# EasyEDA schematic C128toSCART_SMT_V2_2021-01-28.json

## Sheets
1 C128toSCART_SMT_V2#2: TITLE: C128toSCART_SMT_V2; REV: 2.0; Date: 2020-05-27; Sheet: 2/2; Drawn By: Jdet; Company: JDet
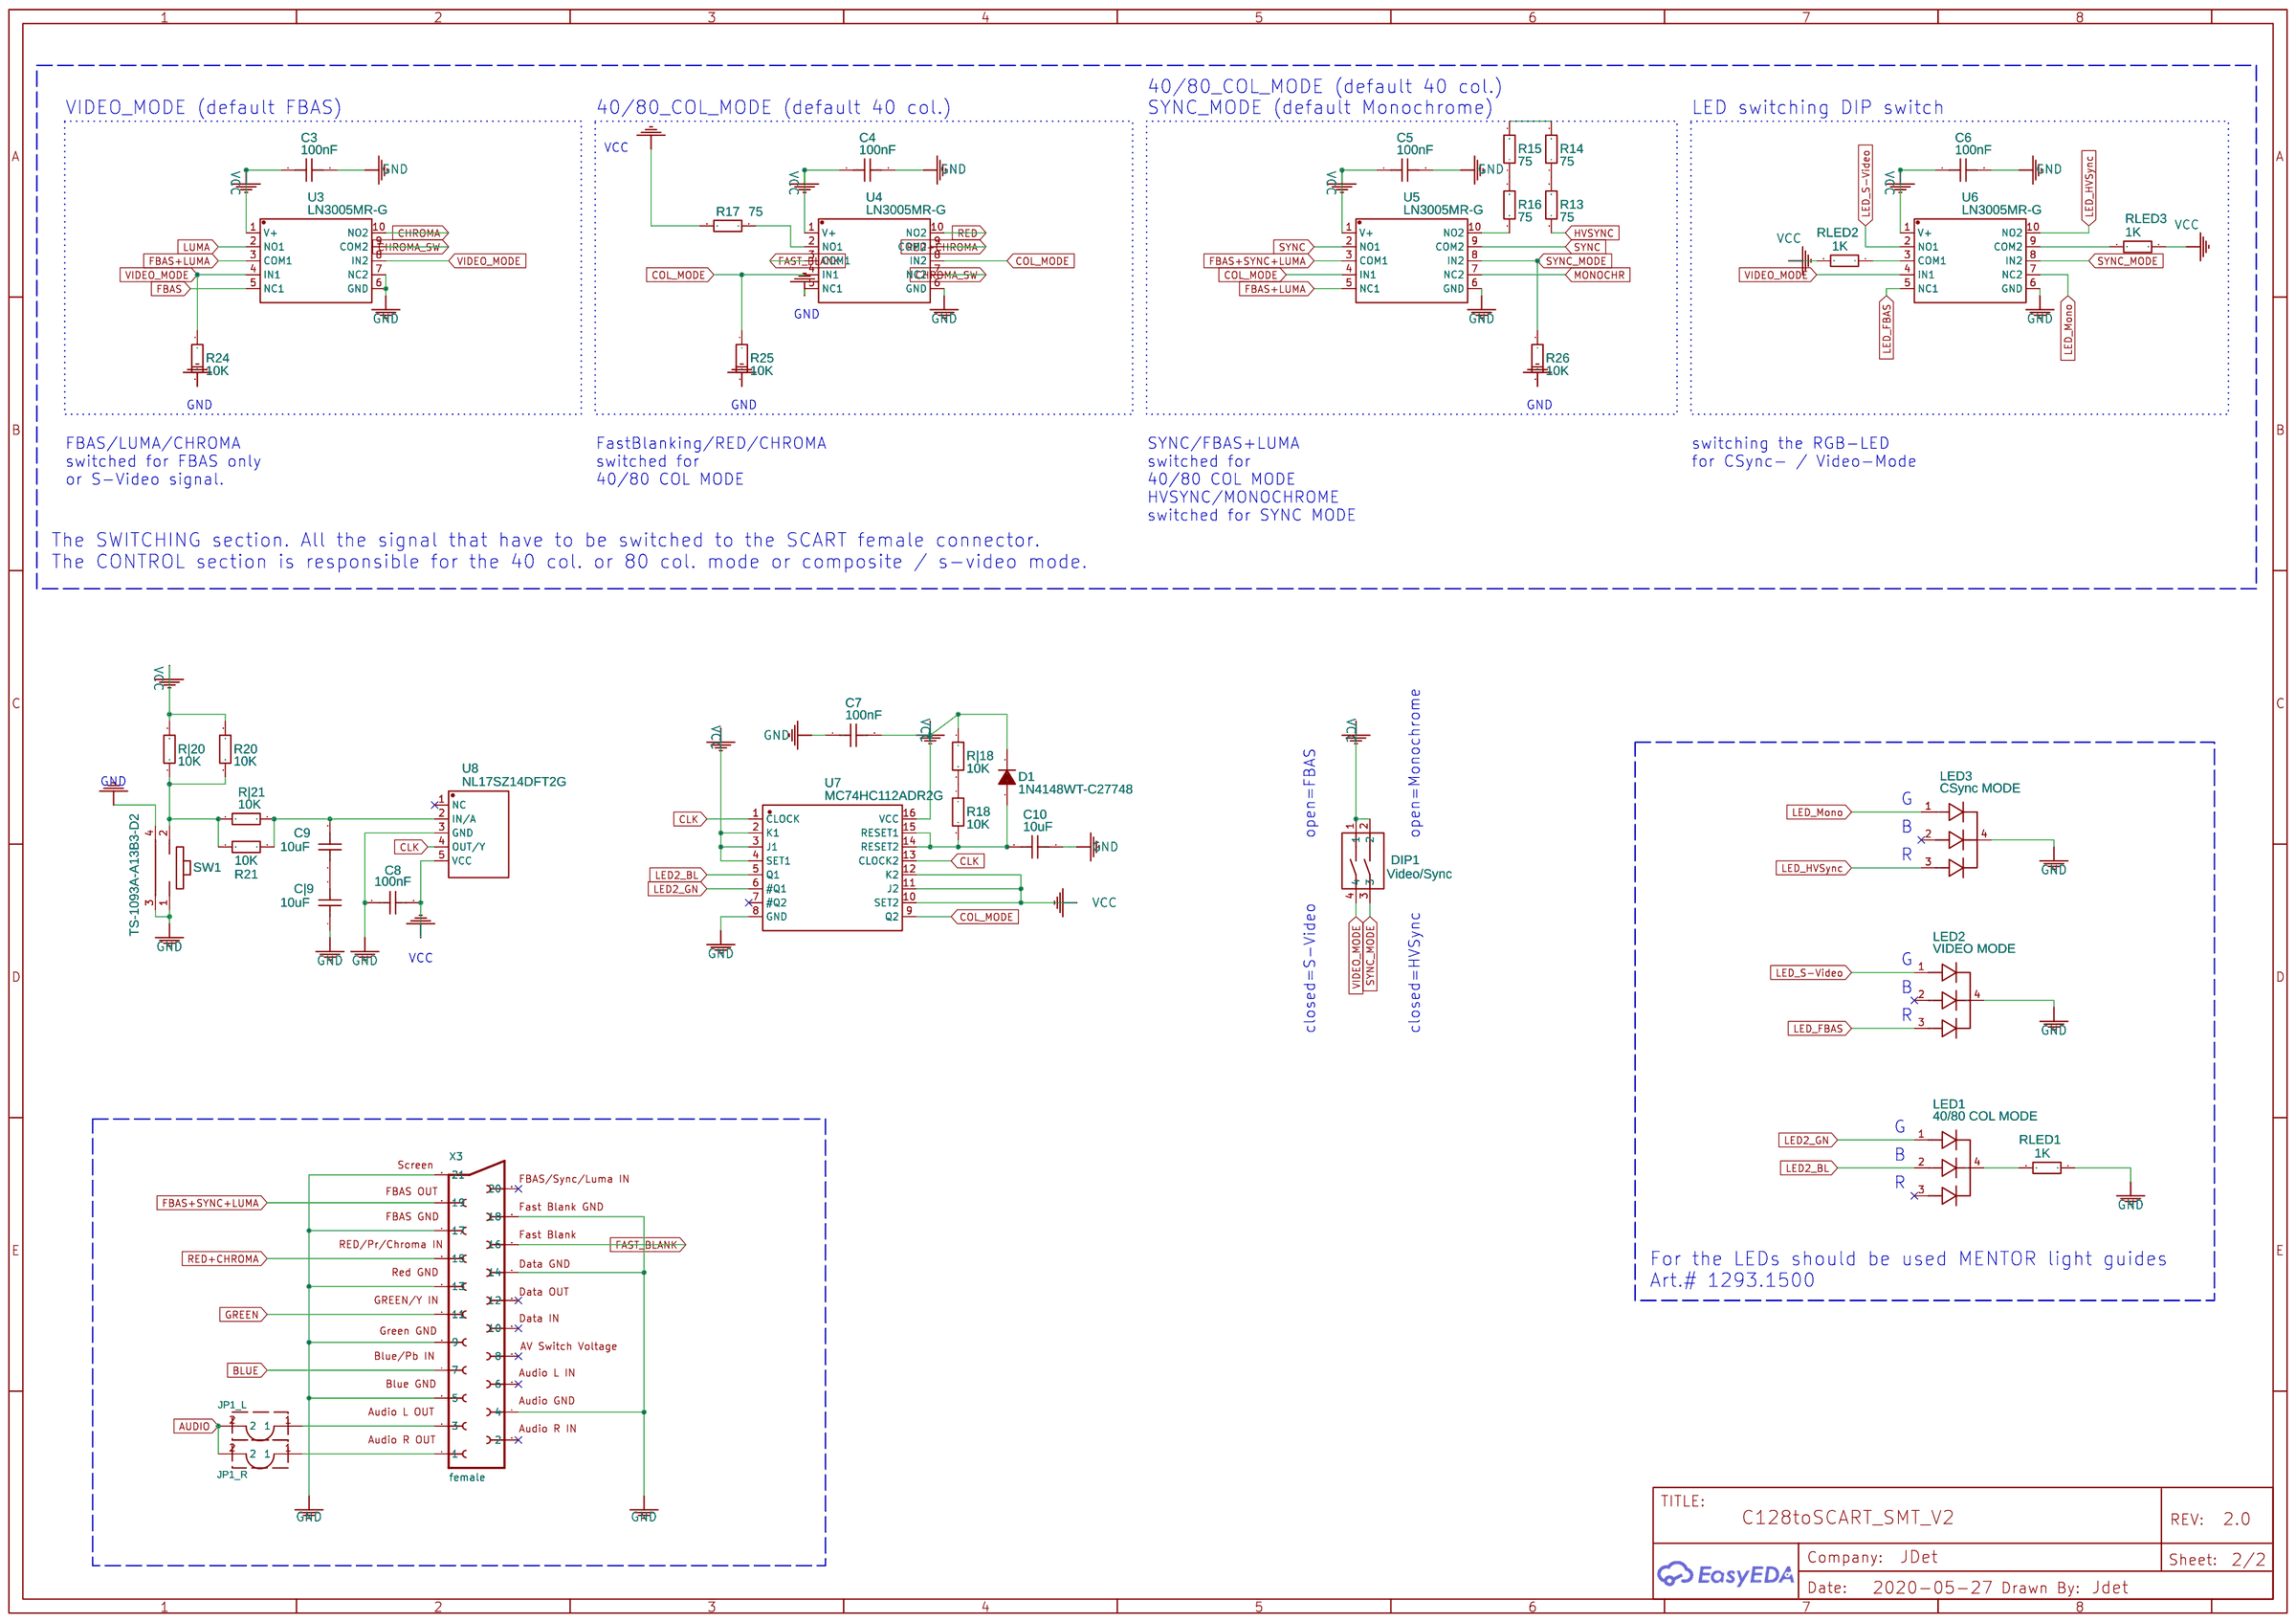
[diagram p0: C128toSCART_SMT_V2#2]
2 C128toSCART_SMT_V2#1: Sheet: 1/2; Drawn By: JDet
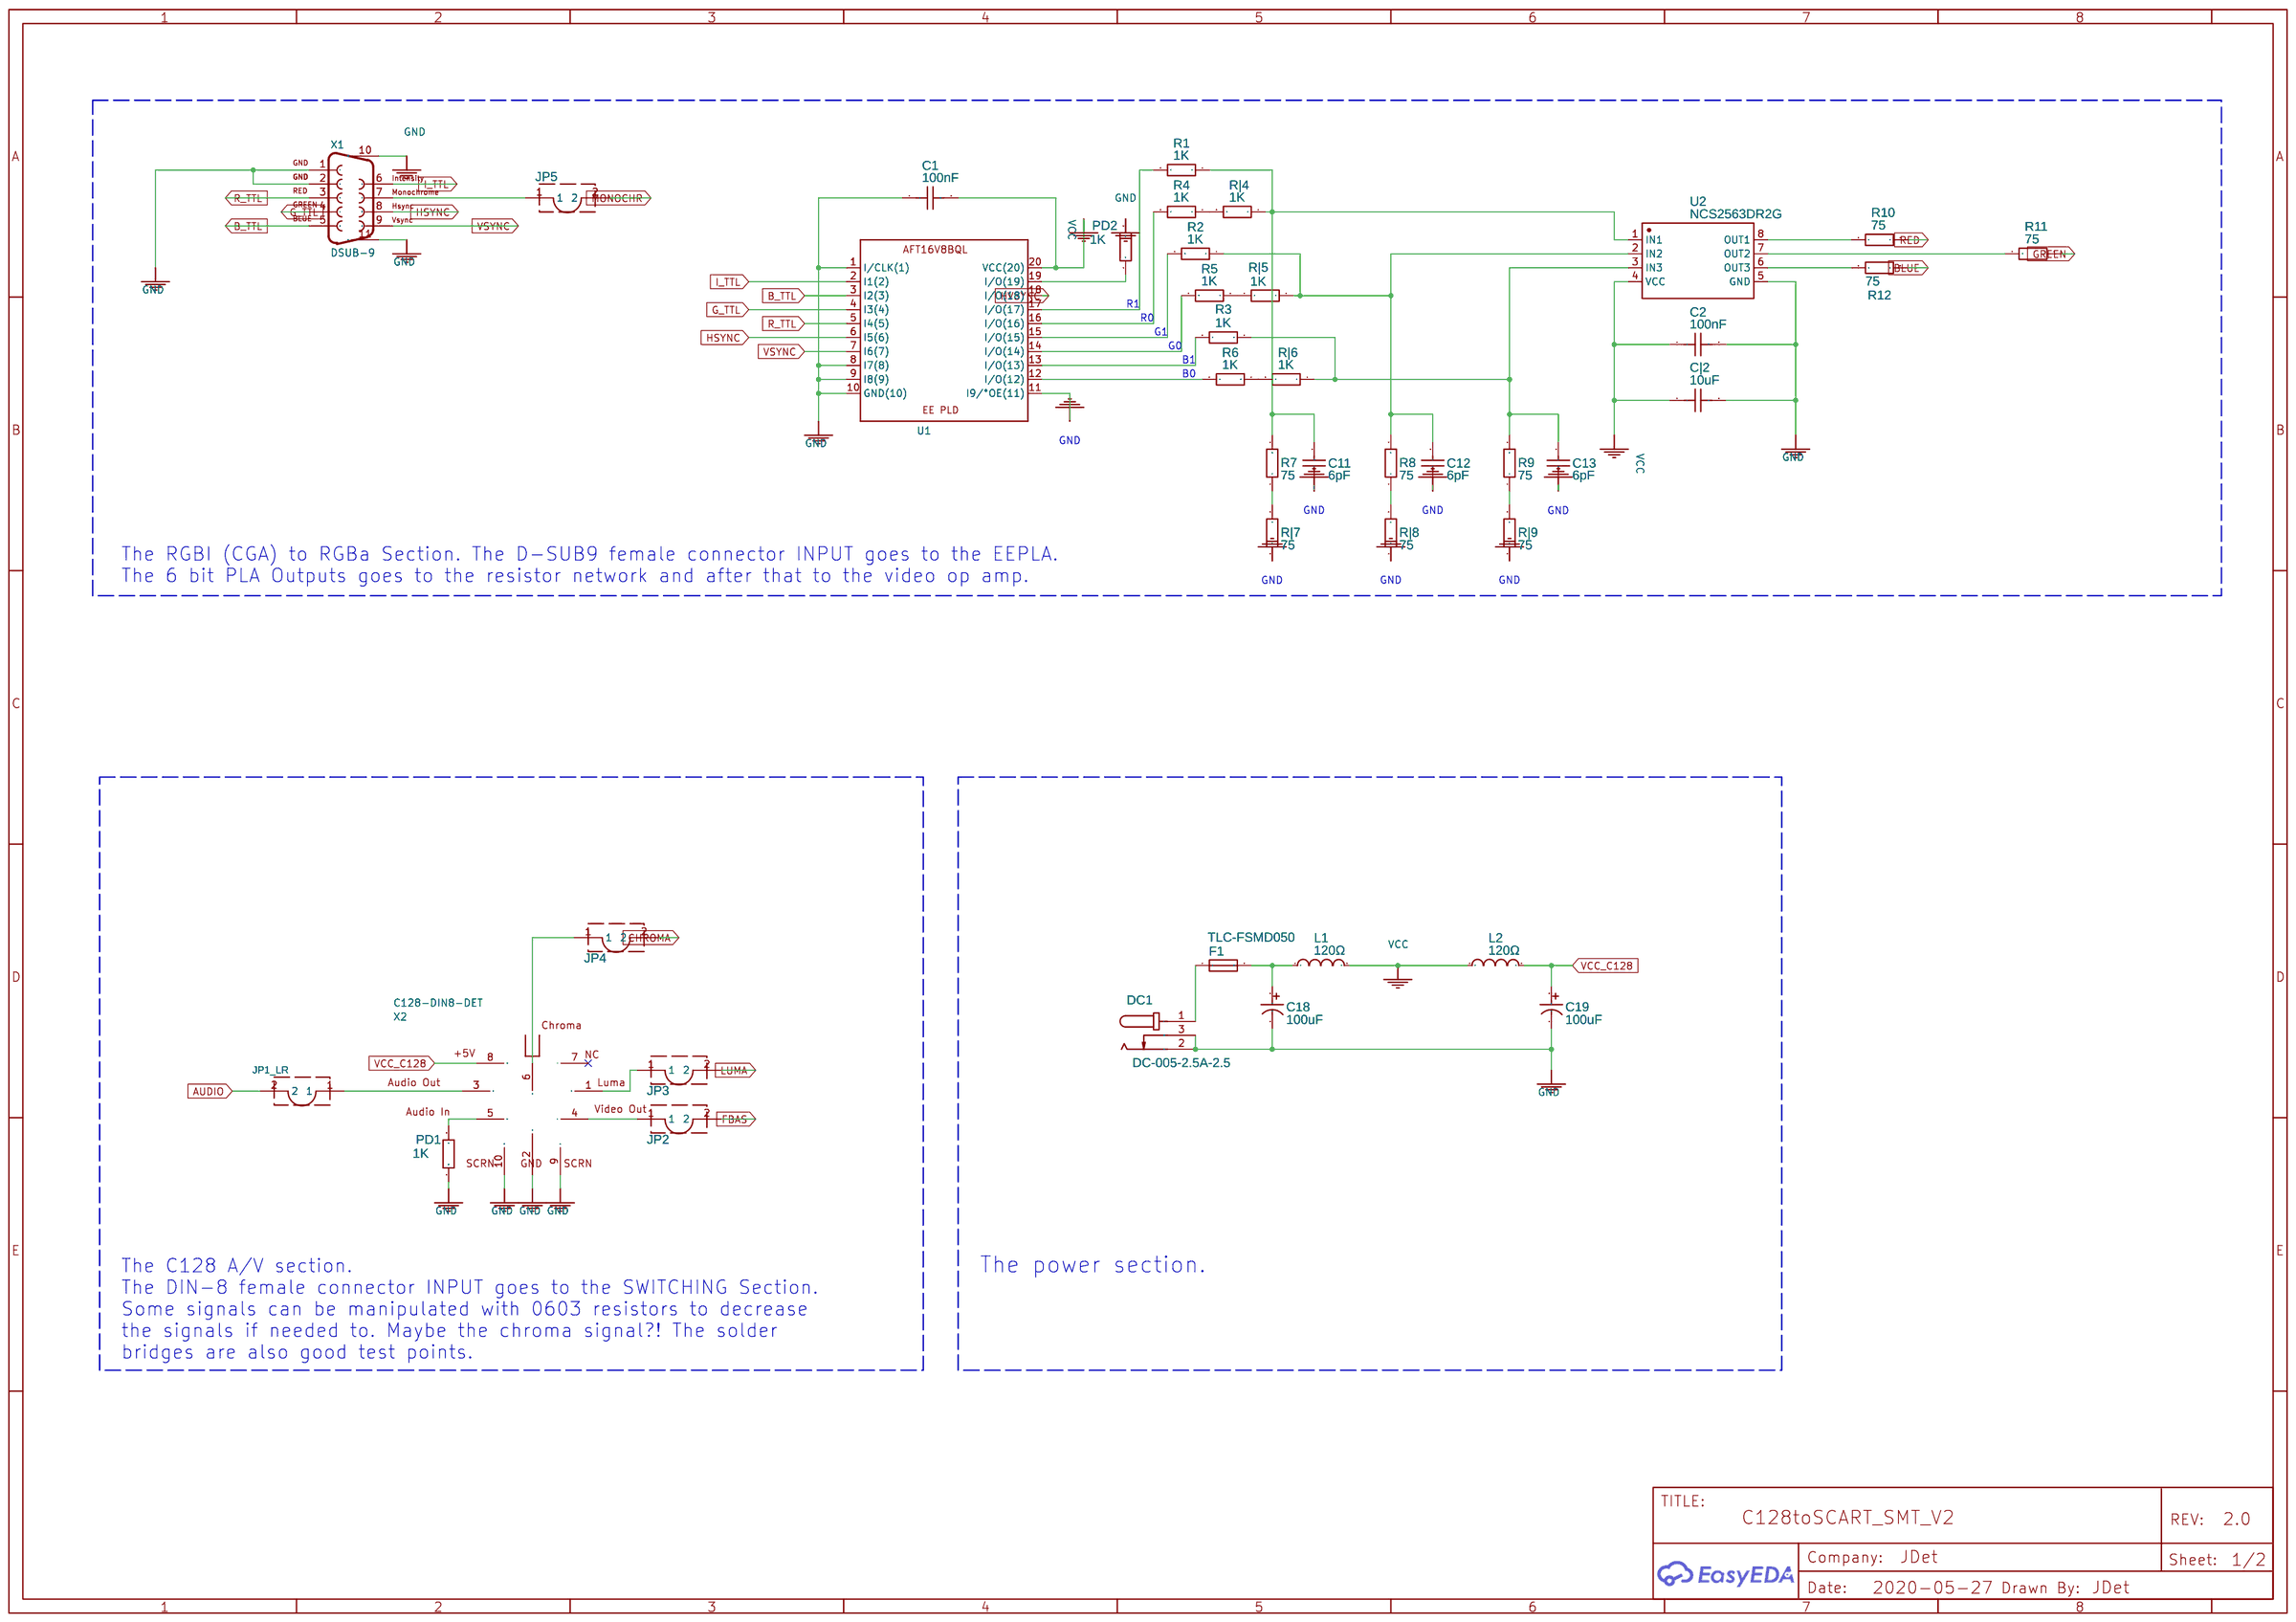
[diagram p1: C128toSCART_SMT_V2#1]

## Parts
sheet C128toSCART_SMT_V2#1
C1  100nF  [C0603]
C2  100nF  [C0603]
C11  6pF  [C0603]
C12  6pF  [C0603]
C13  6pF  [C0603]
C18  100uF  [CAP-SMD_BD5.0-L5.3-W5.3-RD]
C19  100uF  [CAP-SMD_BD5.0-L5.3-W5.3-RD]
C|2  10uF  [C0603]
DC1  DC-005-2.5A-2.5  [CONN-TH_DC-005-2.5A-2.0]
F1  TLC-FSMD050  [F0603]
JP1_LR  JUMPER_CLOSED  [JP_SMD_0603_CLOSED]
JP2  JUMPER_CLOSED  [JP_SMD_0603_CLOSED]
JP3  JUMPER_CLOSED  [JP_SMD_0603_CLOSED]
JP4  JUMPER_CLOSED  [JP_SMD_0603_CLOSED]
JP5  JUMPER_CLOSED  [JP_SMD_0603_CLOSED]
L1  120Ω  [L0603]
L2  120Ω  [L0603]
PD1  1K  [R0603]
PD2  1K  [R0603]
R1  1K  [R0603]
R2  1K  [R0603]
R3  1K  [R0603]
R4  1K  [R0603]
R5  1K  [R0603]
R6  1K  [R0603]
R7  75  [R0603]
R8  75  [R0603]
R9  75  [R0603]
R10  75  [R0603]
R11  75  [R0603]
R12  75  [R0603]
R|4  1K  [R0603]
R|5  1K  [R0603]
R|6  1K  [R0603]
R|7  75  [R0603]
R|8  75  [R0603]
R|9  75  [R0603]
U1  ATF16V8BQ  [ATF16V8_DIL20]
U2  NCS2563DR2G  [SOIC-8_L4.9-W3.9-P1.27-LS6.0-BL]
X1  DSUB-9  [F09HP]
X2  C128-DIN8-DET  [C128-DIN8]
sheet C128toSCART_SMT_V2#2
C3  100nF  [C0603]
C4  100nF  [C0603]
C5  100nF  [C0603]
C6  100nF  [C0603]
C7  100nF  [C0603]
C8  100nF  [C0603]
C9  10uF  [C0603]
C10  10uF  [C0603]
C|9  10uF  [C0603]
D1  1N4148WT-C27748  [SOD-523_L1.2-W0.8-LS1.6-RD]
DIP1  Video/Sync  [SW-SMD_HAD-02HWA-R]
JP1_L  JUMPER_CLOSED  [JP_SMD_0603_CLOSED]
JP1_R  JUMPER_CLOSED  [JP_SMD_0603_CLOSED]
LED1  40/80 COL MODE  [LED-ARRAY-SMD_4P-L1.6-W1.5-BL-FD]
LED2  VIDEO MODE  [LED-ARRAY-SMD_4P-L1.6-W1.5-BL-FD]
LED3  CSync MODE  [LED-ARRAY-SMD_4P-L1.6-W1.5-BL-FD]
R13  75  [R0603]
R14  75  [R0603]
R15  75  [R0603]
R16  75  [R0603]
R17  75  [R0603]
R18  10K  [R0603]
R20  10K  [R0603]
R21  10K  [R0603]
R24  10K  [R0603]
R25  10K  [R0603]
R26  10K  [R0603]
RLED1  1K  [R0603]
RLED2  1K  [R0603]
RLED3  1K  [R0603]
R|18  10K  [R0603]
R|20  10K  [R0603]
R|21  10K  [R0603]
SW1  TS-1093A-A13B3-D2  [KEY-TH_4P-L7.1-W12.9-P4.50-LS2.5]
U3  LN3005MR-G  [MSOP-10_L3.0-W3.0-P0.50-LS5.0-BL]
U4  LN3005MR-G  [MSOP-10_L3.0-W3.0-P0.50-LS5.0-BL]
U5  LN3005MR-G  [MSOP-10_L3.0-W3.0-P0.50-LS5.0-BL]
U6  LN3005MR-G  [MSOP-10_L3.0-W3.0-P0.50-LS5.0-BL]
U7  MC74HC112ADR2G  [SOIC-16_L9.9-W3.9-P1.27-LS6.0-BL]
U8  NL17SZ14DFT2G  [SOT-353_L2.2-W1.4-P0.65-LS2.4-BR]
X3  female  [SCART-F-1H]

## Library data of the parts
C1-C8 = CC0603KRX7R9BB104: Supplier: LCSC; Manufacturer: YAGEO; LCSC Assembly: Yes; Supplier Part: C14663; SMT Type: Basic
C11-C13 = 0603CG6R0C500NT: Supplier: LCSC; Manufacturer: FH; LCSC Assembly: Yes; Supplier Part: C37474; SMT Type: Basic
C18 C19 = VZS101M1ATR-0506: Supplier: LCSC; Manufacturer: LELON; Contributor: LCSC; Supplier Part: C140924; LCSC Assembly: Yes; SMT Type: Extend
C9 C10 C|2 C|9 = CL10A106KP8NNNC: Supplier: LCSC; Manufacturer: SAMSUNG; LCSC Assembly: Yes; Supplier Part: C19702; SMT Type: Basic
DC1 = DC-005-2.5A-2.5: Supplier: LCSC; Supplier Part: C319098; Manufacturer: XKB Enterprise; Contributor: LCSC
F1 = TLC-FSMD050: Supplier: LCSC; Supplier Part: C261937; Manufacturer: TLC Electronic; Contributor: LCSC; LCSC Assembly: Yes; SMT Type: Extend
JP1_L JP1_LR JP1_R JP2-JP5 = JUMPER_CLOSED: catid: 20; Contributor: tdettling; sim: true
L1 L2 = GZ1608D121TF: Supplier: LCSC; Manufacturer: Sunlord; Supplier Part: C18527; LCSC Assembly: Yes; SMT Type: Extend
PD1 PD2 R1-R6 RLED1-RLED3 R|4-R|6 = TC0325F1001T5E: Supplier: LCSC; Manufacturer: UniOhm; Contributor: LCSC; Supplier Part: C128783; LCSC Assembly: Yes; SMT Type: Extend
R7-R17 R|7-R|9 = TC0325B750JT5E: Supplier: LCSC; Manufacturer: UniOhm; Contributor: LCSC; Supplier Part: C146567; LCSC Assembly: Yes; SMT Type: Extend
U2 = NCS2563DR2G: Supplier Part: C97773; Supplier: LCSC; Manufacturer: ON; LCSC Assembly: Yes; SMT Type: Extend
X2 = -: Package Display: No
D1 = 1N4148WT-C27748: Supplier: LCSC; Manufacturer: SEMTECH; Manufacturer Part: 1N4148WT; image: //image.lceda.cn/szlcsc/C27748.jpg; Supplier Part: C27748; LCSC Assembly: Yes; SMT Type: Extend
DIP1 = HAD-02HWA-R: Supplier: LCSC; Manufacturer: ReliaPro; image: //image.lceda.cn/szlcsc/C4669.jpg; Supplier Part: C4669
LED1-LED3 = TJ-S1615SW6TGLCCSRGB-A5: Supplier: LCSC; Supplier Part: C273611; Manufacturer: TOGIALED; Contributor: LCSC; LCSC Assembly: Yes; SMT Type: Extend
R18 R20 R21 R24-R26 R|18 R|20 R|21 = TC0310B1002T5E: Supplier: LCSC; Supplier Part: C190321; Manufacturer: Uniroyal Elec; Contributor: LCSC; LCSC Assembly: Yes; SMT Type: Extend
SW1 = TS-1093A-A13B3-D2: Supplier: LCSC; Supplier Part: C499320; Manufacturer: Yuandi; Contributor: LCSC
U3-U6 = LN3005MR-G: Supplier: LCSC; Supplier Part: C236380; Manufacturer: NATLINEAR; Contributor: LCSC; LCSC Assembly: Yes; SMT Type: Extend
U7 = MC74HC112ADR2G: Supplier: LCSC; Supplier Part: C233600; Manufacturer: ON Semicon; Contributor: LCSC
U8 = NL17SZ14DFT2G: Supplier: LCSC; Manufacturer: ON; Supplier Part: C113256; LCSC Assembly: Yes; SMT Type: Extend

## Nets
GND: C1.1 C2.2 C3.2 C4.2 C5.2 C6.2 C7.1 C8.1 C10.1 C11.1 C12.1 C13.1 C18.2 C19.2 C|2.2 C|9.1 DC1.2 DC1.3 LED2.4 LED3.4 PD1.1 PD2.2 R24.2 R25.2 R26.2 RLED1.1 R|7.1 R|8.1 R|9.1 SW1.1 SW1.3 SW1.4 U1.1(I/CLK(1)) U1.8(I7(8)) U1.9(I8(9)) U1.10(GND(10)) U1.11(I9/°OE(11)) U2.5(GND) U3.6(GND) U3.7(NC2) U4.5(NC1) U4.6(GND) U5.6(GND) U6.6(GND) U7.8(GND) U8.3(GND) X1.1 X1.2 X1.10 X1.11 X2.2 X2.9 X2.10 X3.4 X3.5 X3.9 X3.13 X3.14 X3.17 X3.18 X3.21
VCC: C1.2 C2.1 C3.1 C4.1 C5.1 C6.1 C7.2 C8.2 C|2.1 D1.1(K) DIP1.1 DIP1.2 L1.2 L2.1 R17.2 R20.2 RLED2.2 RLED3.1 R|18.1 R|20.2 U1.20(VCC(20)) U2.4(VCC) U3.1(V+) U4.1(V+) U5.1(V+) U6.1(V+) U7.2(K1) U7.3(J1) U7.4(SET1) U7.10(SET2) U7.11(J2) U7.12(K2) U7.16(VCC) U8.5(VCC)
VCC_C128: C19.1 L2.2 X2.8
AUDIO: JP1_L.2 JP1_LR.2 JP1_R.2
B_TTL: U1.3(I2(3)) X1.5
BLUE: R12.1 X3.7
CHROMA: JP4.2 U3.10(NO2)
CHROMA_SW: U3.9(COM2) U4.7(NC2)
CLK: U7.1(CLOCK) U7.13(CLOCK2) U8.4(OUT/Y)
COL_MODE: R25.1 U4.4(IN1) U4.8(IN2) U5.4(IN1) U7.9(Q2)
FAST_BLANK: U4.3(COM1) X3.16
FBAS: JP2.2 U3.5(NC1)
FBAS+LUMA: U3.3(COM1) U5.5(NC1)
FBAS+SYNC+LUMA: U5.3(COM1) X3.19
G_TTL: U1.4(I3(4)) X1.4
GREEN: R11.1 X3.11
HSYNC: U1.6(I5(6)) X1.8
HVSYNC: R13.1 U1.18(I/O(18))
I_TTL: U1.2(I1(2)) X1.6
LED2_BL: LED1.2(B) U7.5(Q1)
LED2_GN: LED1.1(G) U7.6(#Q1)
LED_FBAS: LED2.3(R) U6.5(NC1)
LED_HVSync: LED3.3(R) U6.10(NO2)
LED_Mono: LED3.1(G) U6.7(NC2)
LED_S-Video: LED2.1(G) U6.2(NO1)
LUMA: JP3.2 U3.2(NO1)
MONOCHR: JP5.2 U5.7(NC2)
R_TTL: U1.5(I4(5)) X1.3
RED: R10.1 U4.10(NO2)
RED+CHROMA: U4.9(COM2) X3.15
SYNC: U5.2(NO1) U5.9(COM2)
SYNC_MODE: DIP1.3 R26.1 U5.8(IN2) U6.8(IN2)
VIDEO_MODE: DIP1.4 R24.1 U3.4(IN1) U3.8(IN2) U6.4(IN1)
VSYNC: U1.7(I6(7)) X1.9
Net-(C9-1): C9.1 C|9.2
Net-(C9-2): C9.2 R21.1 R|21.1 U8.2(IN/A)
Net-(C10-2): C10.2 D1.2(A) R18.2 U7.14(RESET2) U7.15(RESET1)
Net-(C11-2): C11.2 R1.1 R7.2 R|4.1 U2.1(IN1)
Net-(C12-2): C12.2 R2.1 R8.2 R|5.1 U2.2(IN2)
Net-(C13-2): C13.2 R3.1 R9.2 R|6.1 U2.3(IN3)
Net-(C18-1): C18.1 F1.2 L1.1
Net-(DC1-1): DC1.1 F1.1
Net-(JP1_L-1): JP1_L.1 X3.3
Net-(JP1_LR-1): JP1_LR.1 X2.3
Net-(JP1_R-1): JP1_R.1 X3.1
Net-(JP2-1): JP2.1 X2.4
Net-(JP3-1): JP3.1 X2.1
Net-(JP4-1): JP4.1 X2.6
Net-(JP5-1): JP5.1 X1.7
Net-(LED1-4): LED1.4 RLED1.2
Net-(PD1-2): PD1.2 X2.5
Net-(PD2-1): PD2.1 U1.19(I/O(19))
Net-(R1-2): R1.2 U1.17(I/O(17))
Net-(R2-2): R2.2 U1.15(I/O(15))
Net-(R3-2): R3.2 U1.13(I/O(13))
Net-(R4-1): R4.1 R|4.2
Net-(R4-2): R4.2 U1.16(I/O(16))
Net-(R5-1): R5.1 R|5.2
Net-(R5-2): R5.2 U1.14(I/O(14))
Net-(R6-1): R6.1 R|6.2
Net-(R6-2): R6.2 U1.12(I/O(12))
Net-(R7-1): R7.1 R|7.2
Net-(R8-1): R8.1 R|8.2
Net-(R9-1): R9.1 R|9.2
Net-(R10-2): R10.2 U2.8(OUT1)
Net-(R11-2): R11.2 U2.7(OUT2)
Net-(R12-2): R12.2 U2.6(OUT3)
Net-(R13-2): R13.2 R14.1
Net-(R14-2): R14.2 R15.2
Net-(R15-1): R15.1 R16.2
Net-(R16-1): R16.1 U5.10(NO2)
Net-(R17-1): R17.1 U4.2(NO1)
Net-(R18-1): R18.1 R|18.2
Net-(R20-1): R20.1 R21.2 R|20.1 R|21.2 SW1.2
Net-(RLED2-1): RLED2.1 U6.3(COM1)
Net-(RLED3-2): RLED3.2 U6.9(COM2)

Not connected (* = marked no-connect by the designer): LED1 3(R)*; LED2 2(B)*; LED3 2(B)*; U7 7(#Q2)*; U8 1(NC)*; X2 7*; X3 2* 6* 8* 10* 12* 20*

## Notes on the sheets
sheet 1
- 40/80_COL_MODE (default 40 col.)
- VIDEO_MODE (default FBAS)
- 40/80_COL_MODE (default 40 col.)
- SYNC_MODE (default Monochrome)
- LED switching DIP switch
- FBAS/LUMA/CHROMA
  switched for FBAS only
  or S-Video signal.
- FastBlanking/RED/CHROMA
  switched for
  40/80 COL MODE
- SYNC/FBAS+LUMA
  switched for
  40/80 COL MODE
  HVSYNC/MONOCHROME
  switched for SYNC MODE
- switching the RGB-LED
  for CSync- / Video-Mode
- The SWITCHING section. All the signal that have to be switched to the SCART female connector.
  The CONTROL section is responsible for the 40 col. or 80 col. mode or composite / s-video mode.
- G
- B
- open=FBAS
- open=Monochrome
- R
- G
- B
- R
- closed=S-Video
- closed=HVSync
- G
- B
- R
- For the LEDs should be used MENTOR light guides
  Art.# 1293.1500
sheet 2
- R1
- R0
- G1
- G0
- B1
- B0
- The RGBI (CGA) to RGBa Section. The D-SUB9 female connector INPUT goes to the EEPLA.
  The 6 bit PLA Outputs goes to the resistor network and after that to the video op amp.
- The C128 A/V section.
  The DIN-8 female connector INPUT goes to the SWITCHING Section.
  Some signals can be manipulated with 0603 resistors to decrease
  the signals if needed to. Maybe the chroma signal?! The solder
  bridges are also good test points.
- The power section.
